# Altium project ControlPCB.PrjPcb
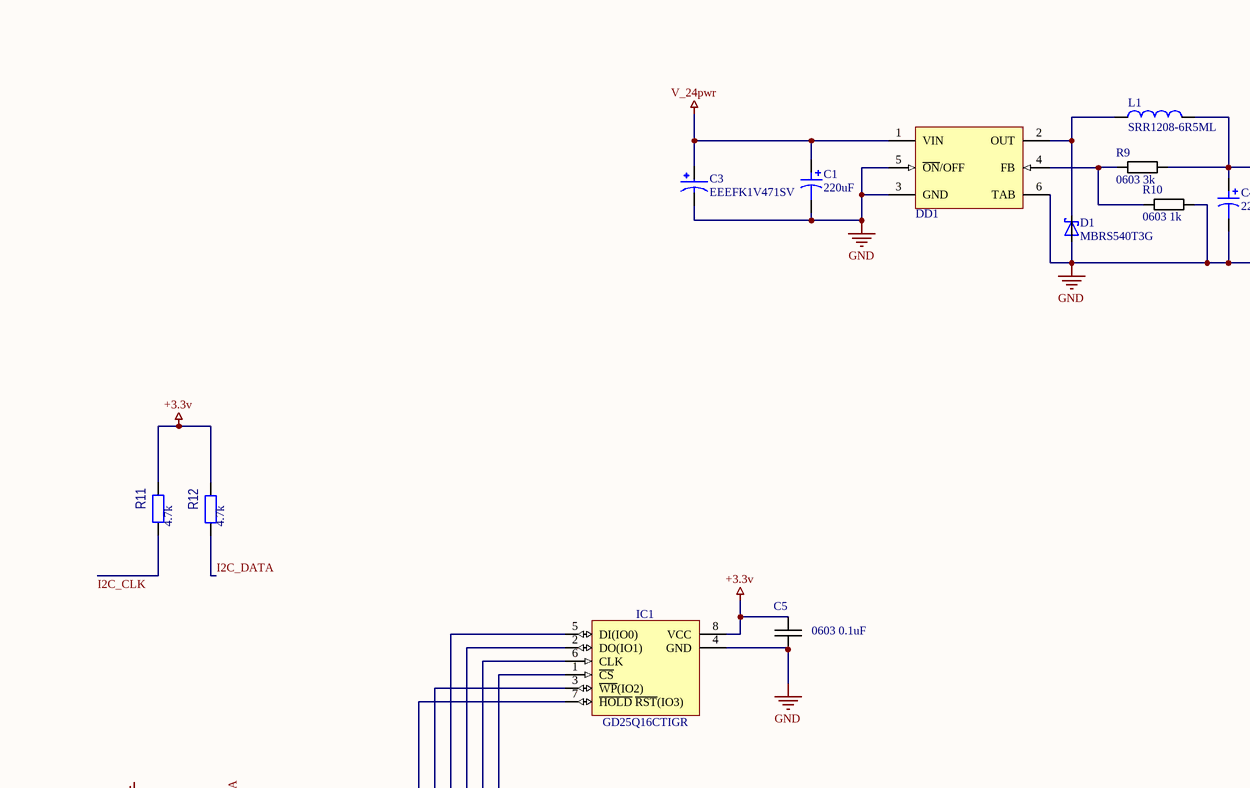
[diagram p0: ControlPCB.SchDoc, top left]
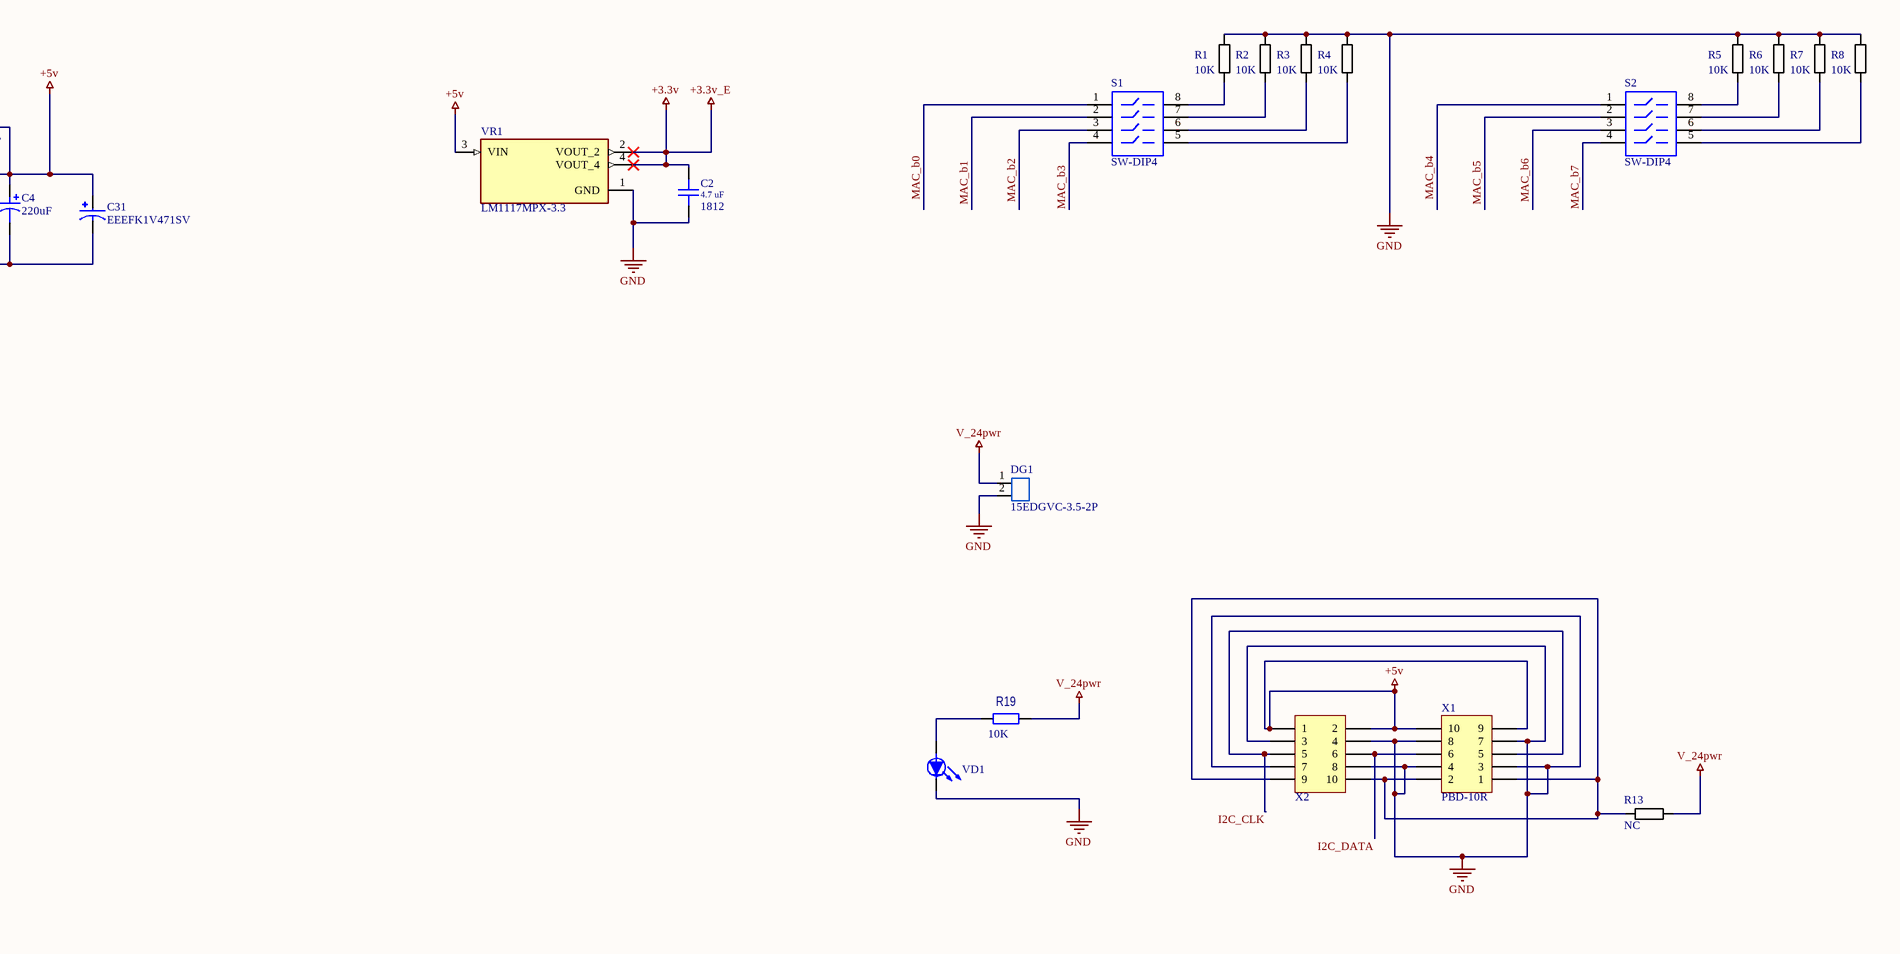
[diagram p1: ControlPCB.SchDoc, top right]
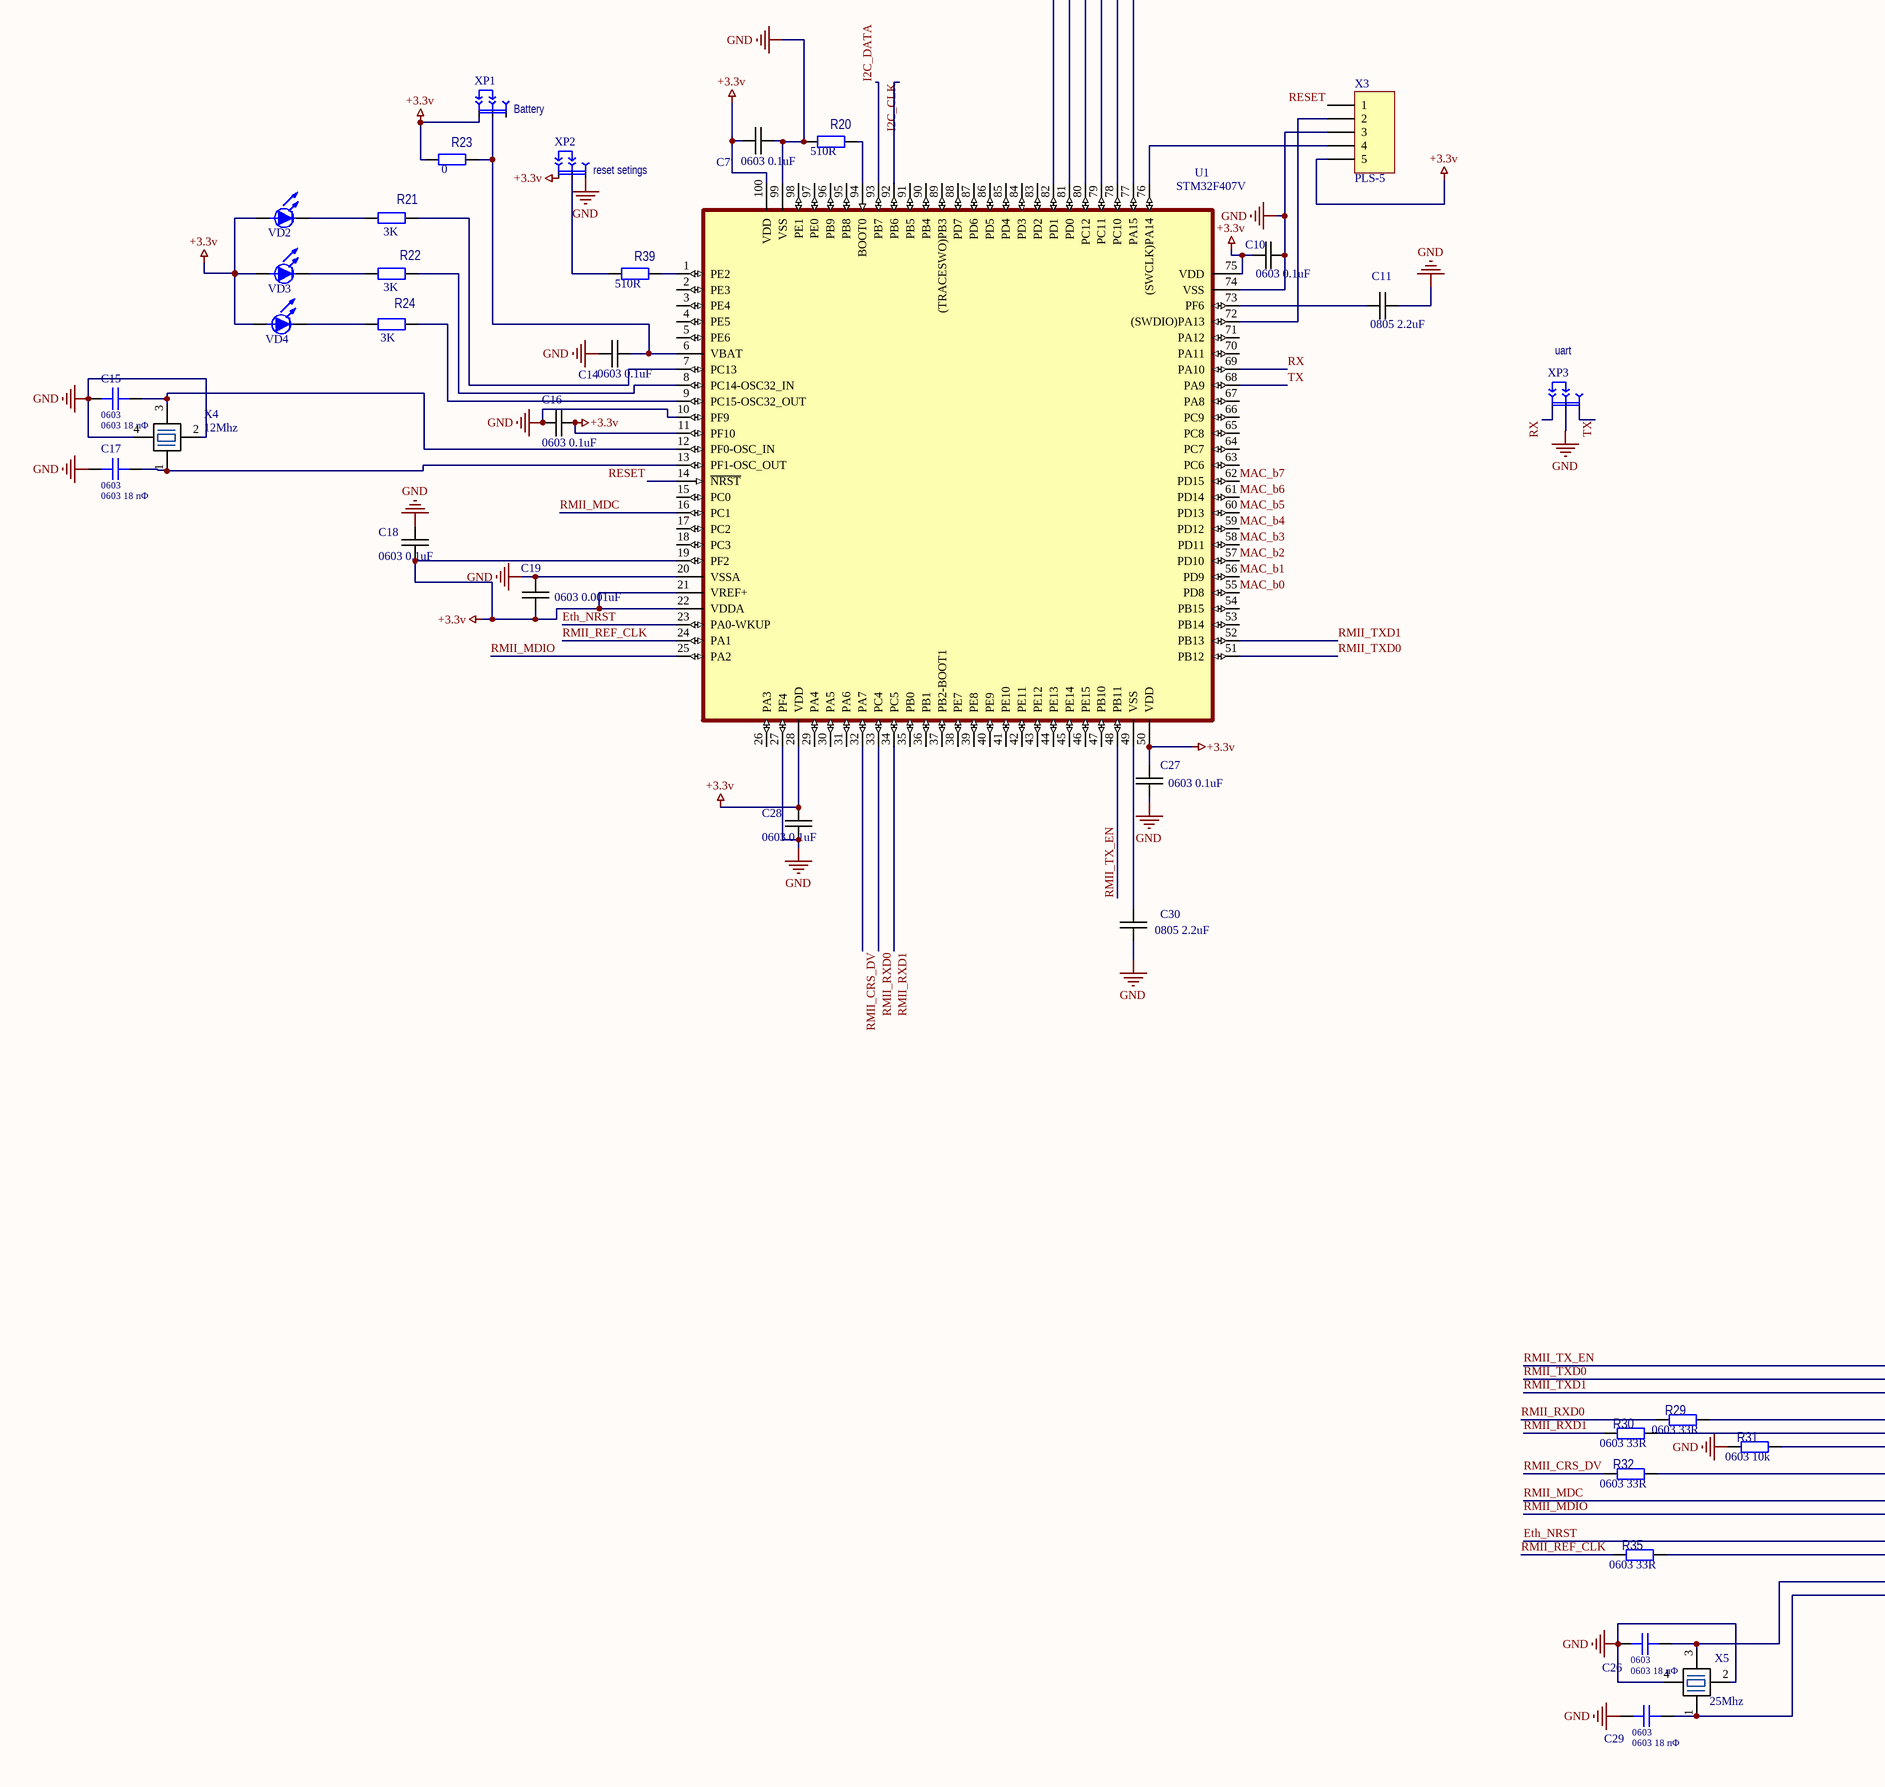
[diagram p2: ControlPCB.SchDoc, bottom left]
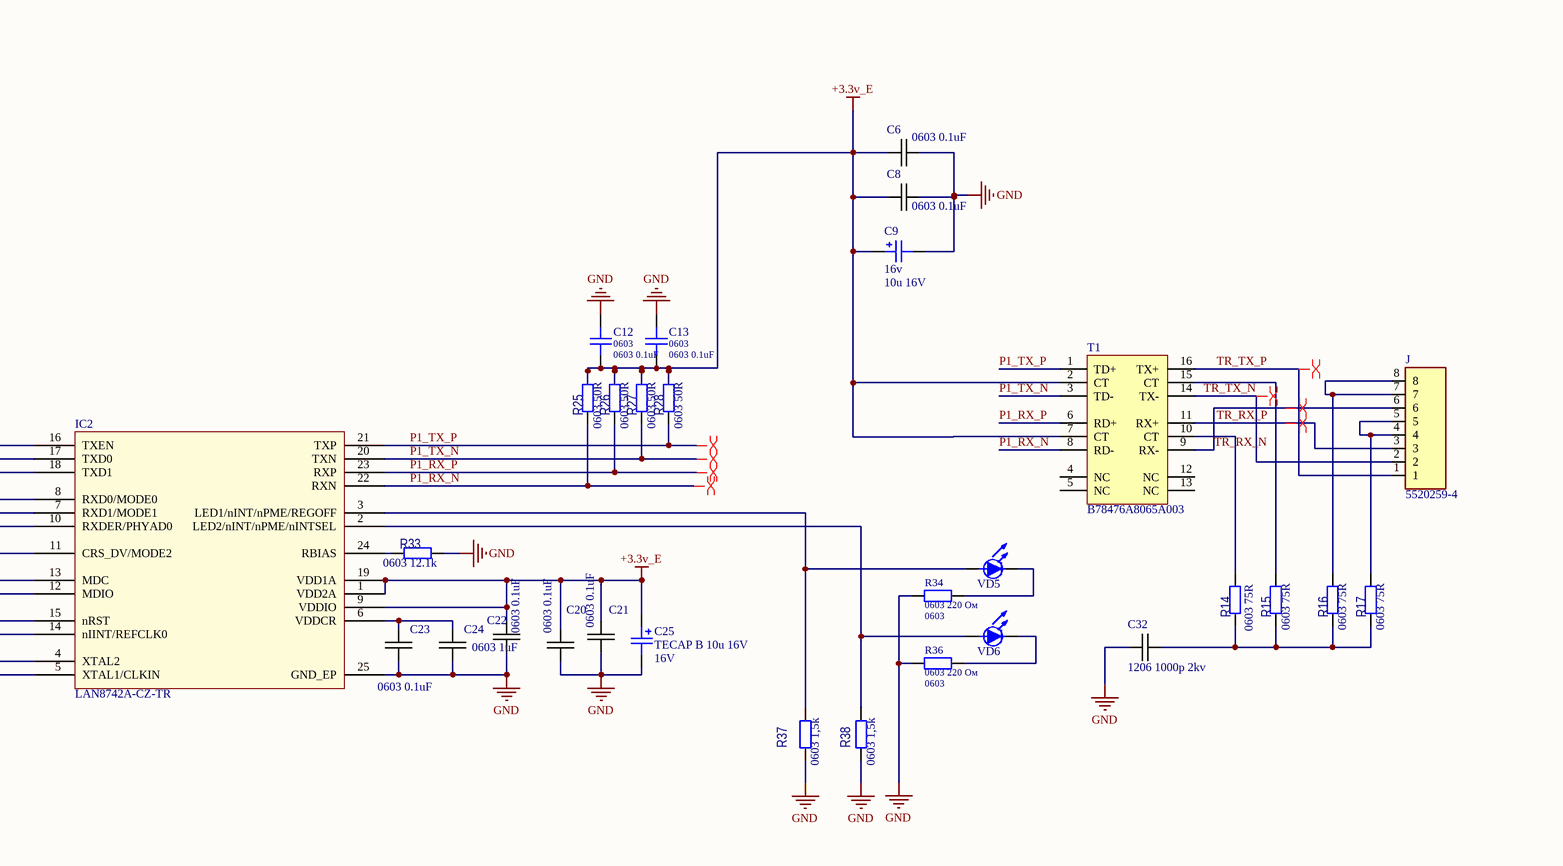
[diagram p3: ControlPCB.SchDoc, bottom right]
1 sheet, 96 parts. Net scope: global (net labels, ports and power ports of the same name join across sheets).
Board file: ControlPCB.PcbDoc

## Sheet ControlPCB.SchDoc
size A1

### Parts
C1  value 220uF  [ECR 10x13mm]  (hidden comment: NC)
C2  value 4.7 uF  Package: 1812  [CAPCHIP1812]  (hidden comment: Cap C)
C3  EEEFK1V471SV  [CAP_EEEFK1V471SV]
C4  value 220uF  [ECR 10x13mm]  (hidden comment: NC)
C5  0603 0.1uF  [CAPACITOR 0603]
C6  0603 0.1uF  [CAPACITOR 0603]
C7  0603 0.1uF  [CAPACITOR 0603]
C8  0603 0.1uF  [CAPACITOR 0603]
C9  value 10u 16V  Voltage: 16v  [TECAP B]  (hidden comment: Cap T)
C10  0603 0.1uF  [CAPACITOR 0603]
C11  0805 2.2uF  [CAPACITOR 0805]
C12  Type: 0603  [CAPCHIP0603]  (hidden comment: 0603 0.1uF)
C13  Type: 0603  [CAPCHIP0603]  (hidden comment: 0603 0.1uF)
C14  0603 0.1uF  [CAPACITOR 0603]
C15  Type: 0603  [CAPCHIP0603]  (hidden comment: 0603 18 пФ)
C16  0603 0.1uF  [CAPACITOR 0603]
C17  Type: 0603  [CAPCHIP0603]  (hidden comment: 0603 18 пФ)
C18  0603 0.1uF  [CAPACITOR 0603]
C19  0603 0.001uF  [CAPACITOR 0603]
C20  0603 0.1uF  [CAPACITOR 0603]
C21  0603 0.1uF  [CAPACITOR 0603]
C22  0603 0.1uF  [CAPACITOR 0603]
C23  0603 0.1uF  [CAPACITOR 0603]
C24  0603 1uF  [CAPACITOR 0603]
C25  Voltage: 16V  [TECAP B]  (hidden comment: TECAP B 10u 16V)
C26  Type: 0603  [CAPCHIP0603]  (hidden comment: 0603 18 пФ)
C27  0603 0.1uF  [CAPACITOR 0603]
C28  0603 0.1uF  [CAPACITOR 0603]
C29  Type: 0603  [CAPCHIP0603]  (hidden comment: 0603 18 пФ)
C30  0805 2.2uF  [CAPACITOR 0805]
C31  EEEFK1V471SV  [CAP_EEEFK1V471SV]
C32  1206 1000p 2kv  [CAPACITOR 1206]
D1  MBRS540T3G  [DIOM7958X213N]
DD1  LM2596S-ADJ  [TO-263]  (value not drawn)
DG1  15EDGVC-3.5-2P  [15EDGVC-3.5-16P]
IC1  GD25Q16CTIGR  [NSO8]
IC2  LAN8742A-CZ-TR  [LAN8742A]
J  5520259-4  [TE_5520259-4]
L1  SRR1208-6R5ML  [SRR1208]
R1  10K  [Resistor 0402]
R2  10K  [Resistor 0402]
R3  10K  [Resistor 0402]
R4  10K  [Resistor 0402]
R5  10K  [Resistor 0402]
R6  10K  [Resistor 0402]
R7  10K  [Resistor 0402]
R8  10K  [Resistor 0402]
R9  0603 3k  [Resistor 0603]
R10  0603 1k  [Resistor 0603]
R11  4.7k  [RESCHIP0603]
R12  4.7k  [RESCHIP0603]
R13  NC  [Resistor 1206]
R14  0603 75R  [RESCHIP0603]
R15  0603 75R  [RESCHIP0603]
R16  0603 75R  [RESCHIP0603]
R17  0603 75R  [RESCHIP0603]
R19  10K  [RESCHIP0603]
R20  510R  [RESCHIP0603]
R21  3K  [RESCHIP0603]
R22  3K  [RESCHIP0603]
R23  0  [RESCHIP0603]
R24  3K  [RESCHIP0603]
R25  0603 50R  [RESCHIP0603]
R26  0603 50R  [RESCHIP0603]
R27  0603 50R  [RESCHIP0603]
R28  0603 50R  [RESCHIP0603]
R29  0603 33R  [RESCHIP0603]
R30  0603 33R  [RESCHIP0603]
R31  0603 10k  [RESCHIP0603]
R32  0603 33R  [RESCHIP0603]
R33  0603 12.1k  [RESCHIP0603]
R34  Type: 0603  [RESCHIP0603]  (hidden comment: 0603 220 Ом)
R35  0603 33R  [RESCHIP0603]
R36  Type: 0603  [RESCHIP0603]  (hidden comment: 0603 220 Ом)
R37  0603 1,5k  [RESCHIP0603]
R38  0603 1,5k  [RESCHIP0603]
R39  510R  [RESCHIP0603]
S1  SW-DIP4  [DIP-8]
S2  SW-DIP4  [DIP-8]
T1  B78476A8065A003  [EPCS-B78476A8065A003-16]
U1  STM32F407V  [QFP50P1600X1600X160-100N]
VD1  (no value)  [0805-]
VD2  (no value)  [0805-]
VD3  (no value)  [0805-]
VD4  (no value)  [0805-]
VD5  (no value)  [0805-]
VD6  (no value)  [0805-]
VR1  LM1117MPX-3.3  [VREG_LM1117MPX-3.3]
X1  PBD-10R  [PBD-10RR]
X2  PLD-10R  [PLD-10RR1]  (value not drawn)
X3  PLS-5  [PLS-5-3D]
X4  12Mhz  [XTAL_3.2_2.5]
X5  25Mhz  [XTAL_3.2_2.5]
XP1  Battery  [ZL201-3]
XP2  reset setings  [ZL201-3]
XP3  uart  [ZL201-3]

### Nets
+3.3v: C2.2 C5.1 C6.1 C7.1 C8.1 C9.1 C10.1 C12.1 C13.1 C16.2 C18.2 C19.2 C20.1 C21.2 C22.1 C25.1 C27.1 C28.1 IC1.8(VCC) IC2.1(VDD2A) IC2.9(VDDIO) IC2.19(VDD1A) R11.2 R12.2 R23.1 R25.2 R26.2 R27.2 R28.2 T1.2(CT) T1.7(CT) U1.11(PF10) U1.19(PF2) U1.21(VREF+) U1.22(VDDA) U1.28(VDD) U1.50(VDD) U1.75(VDD) U1.100(VDD) VD2.A(a) VD3.A(a) VD4.A(a) VR1.2(VOUT_2) VR1.4(VOUT_4) X3.5 XP1.1 XP2.1  [also labelled +3.3v_E]
+5v: C4.1 C31.1 L1.P$2 R9.2 VR1.3(VIN) X1.9 X1.10 X2.1 X2.2
GND: C1.2 C2.1 C3.2 C4.2 C5.2 C6.2 C7.2 C8.2 C9.2 C10.2 C11.2 C12.2 C13.2 C14.1 C15.1 C16.1 C17.1 C18.1 C19.1 C20.2 C21.1 C22.2 C23.2 C24.2 C25.2 C26.1 C27.2 C28.2 C29.1 C30.1 C31.2 C32.2 D1.A DD1.3(GND) DD1.5(~{ON}/OFF) DD1.6(TAB) DG1.2 IC1.4(GND) IC2.25(GND_EP) R1.1 R2.1 R3.1 R4.1 R5.1 R6.1 R7.1 R8.1 R10.2 R20.1 R31.1 R33.2 R34.1 R36.1 R37.1 R38.1 U1.10(PF9) U1.20(VSSA) U1.27(PF4) U1.74(VSS) U1.99(VSS) VD1.K(k) VR1.1(GND) X1.3 X1.4 X1.7 X1.8 X2.3 X2.4 X2.7 X2.8 X3.3 X4.2 X4.4 X5.2 X5.4 XP2.3 XP3.2
V_24pwr: C1.1 C3.1 DD1.1(VIN) DG1.1 R13.2 R19.2
Eth_NRST: IC2.15(nRST) U1.23(PA0-WKUP)
I2C_CLK: R11.1 U1.92(PB6) X1.5 X2.5
I2C_DATA: R12.1 U1.93(PB7) X1.6 X2.6
MAC_b0: S1.1 U1.55(PD8)
MAC_b1: S1.2 U1.56(PD9)
MAC_b2: S1.3 U1.57(PD10)
MAC_b3: S1.4 U1.58(PD11)
MAC_b4: S2.1 U1.59(PD12)
MAC_b5: S2.2 U1.60(PD13)
MAC_b6: S2.3 U1.61(PD14)
MAC_b7: S2.4 U1.62(PD15)
P1_RX_N: IC2.22(RXN) R25.1 T1.8(RD-)
P1_RX_P: IC2.23(RXP) R26.1 T1.6(RD+)
P1_TX_N: IC2.20(TXN) R27.1 T1.3(TD-)
P1_TX_P: IC2.21(TXP) R28.1 T1.1(TD+)
RESET: U1.14(~{NRST}) X3.1
RMII_CRS_DV: R32.1 U1.32(PA7)
RMII_MDC: IC2.13(MDC) U1.16(PC1)
RMII_MDIO: IC2.12(MDIO) U1.25(PA2)
RMII_REF_CLK: R35.1 U1.24(PA1)
RMII_RXD0: R29.1 U1.33(PC4)
RMII_RXD1: R30.1 U1.34(PC5)
RMII_TX_EN: IC2.16(TXEN) U1.48(PB11)
RMII_TXD0: IC2.17(TXD0) U1.51(PB12)
RMII_TXD1: IC2.18(TXD1) U1.52(PB13)
RX: U1.69(PA10) XP3.1
TR_RX_N: J.6 T1.9(RX-)
TR_RX_P: J.3 T1.11(RX+)
TR_TX_N: J.2 T1.14(TX-)
TR_TX_P: J.1 T1.16(TX+)
TX: U1.68(PA9) XP3.3
NetC11_1: C11.1 U1.73(PF6)
NetC14_2: C14.2 R23.2 U1.6(VBAT) XP1.2
NetC15_2: C15.2 U1.12(PF0-OSC_IN) X4.3
NetC17_2: C17.2 U1.13(PF1-OSC_OUT) X4.1
NetC23_1: C23.1 C24.1 IC2.6(VDDCR)
NetC26_2: C26.2 IC2.4(XTAL2) X5.3
NetC29_2: C29.2 IC2.5(XTAL1/CLKIN) X5.1
NetC30_2: C30.2 U1.49(VSS)
NetC32_1: C32.1 R14.1 R15.1 R16.1 R17.1
NetD1_C: D1.C DD1.2(OUT) L1.P$1
NetDD1_4: DD1.4(FB) R9.1 R10.1
NetIC1_1: IC1.1(~{CS}) U1.77(PA15)
NetIC1_2: IC1.2(DO(IO1)) U1.79(PC11)
NetIC1_3: IC1.3(~{WP}(IO2)) U1.81(PD0)
NetIC1_5: IC1.5(DI(IO0)) U1.80(PC12)
NetIC1_6: IC1.6(CLK) U1.78(PC10)
NetIC1_7: IC1.7(~{HOLD}_~{RST}(IO3)) U1.82(PD1)
NetIC2_2: IC2.2(LED2/nINT/nPME/nINTSEL) R38.2 VD6.A(a)
NetIC2_3: IC2.3(LED1/nINT/nPME/REGOFF) R37.2 VD5.A(a)
NetIC2_7: IC2.7(RXD1/MODE1) R30.2
NetIC2_8: IC2.8(RXD0/MODE0) R29.2
NetIC2_10: IC2.10(RXDER/PHYAD0) R31.2
NetIC2_11: IC2.11(CRS_DV/MODE2) R32.2
NetIC2_14: IC2.14(nIINT/REFCLK0) R35.2
NetIC2_24: IC2.24(RBIAS) R33.1
NetJ_4: J.4 J.5 R17.2
NetJ_7: J.7 J.8 R16.2
NetR1_2: R1.2 S1.8
NetR2_2: R2.2 S1.7
NetR3_2: R3.2 S1.6
NetR4_2: R4.2 S1.5
NetR5_2: R5.2 S2.8
NetR6_2: R6.2 S2.7
NetR7_2: R7.2 S2.6
NetR8_2: R8.2 S2.5
NetR13_1: R13.1 X1.1 X1.2 X2.9 X2.10
NetR14_2: R14.2 T1.10(CT)
NetR15_2: R15.2 T1.15(CT)
NetR19_1: R19.1 VD1.A(a)
NetR20_2: R20.2 U1.94(BOOT0)
NetR21_1: R21.1 U1.7(PC13)
NetR21_2: R21.2 VD2.K(k)
NetR22_1: R22.1 U1.8(PC14-OSC32_IN)
NetR22_2: R22.2 VD3.K(k)
NetR24_1: R24.1 U1.9(PC15-OSC32_OUT)
NetR24_2: R24.2 VD4.K(k)
NetR34_2: R34.2 VD5.K(k)
NetR36_2: R36.2 VD6.K(k)
NetR39_1: R39.1 XP2.2
NetR39_2: R39.2 U1.1(PE2)
NetU1_72: U1.72((SWDIO)PA13) X3.2
NetU1_76: U1.76((SWCLK)PA14) X3.4

Not connected (* = marked no-connect by the designer): T1 4(NC) 5(NC) 12(NC) 13(NC); U1 2(PE3) 3(PE4) 4(PE5) 5(PE6) 15(PC0) 17(PC2) 18(PC3) 26(PA3) 29(PA4) 30(PA5) 31(PA6) 35(PB0) 36(PB1) 37(PB2-BOOT1) 38(PE7) 39(PE8) 40(PE9) 41(PE10) 42(PE11) 43(PE12) 44(PE13) 45(PE14) 46(PE15) 47(PB10) 53(PB14) 54(PB15) 63(PC6) 64(PC7) 65(PC8) 66(PC9) 67(PA8) 70(PA11) 71(PA12) 83(PD2) 84(PD3) 85(PD4) 86(PD5) 87(PD6) 88(PD7) 89((TRACESWO)PB3) 90(PB4) 91(PB5) 95(PB8) 96(PB9) 97(PE0) 98(PE1); XP1 3

### Layout directives
differential pair: P1_RX_N, P1_RX_P, P1_TX_N, P1_TX_P, TR_RX_N, TR_RX_P, TR_TX_N, TR_TX_P

### Library data of the parts
C1 C4 = Cap Pol: Polarized Capacitor (Rad); Voltage: 50; Type: Type; URL: http://www.hitano.com.tw/PDF/ECR_081225.pdf; Package: 10x13
C2 = Cap C: Ceramic Capacitor; Class: Электронные компоненты; SubClass: Конденсаторы; TKE: {TKE}; Ordering_Information: {Ordering_Information}; Installation: {Installation}; Body: {Body}; Nominal_voltage_V: {Nominal_voltage_V}; Tolerance_Percent: {Tolerance_Percent}; Pins: {Pins}
C3 C31 = EEEFK1V471SV: 470ÂµF 35V Aluminum Electrolytic Capacitors Radial, Can - SMD 80mOhm @ 100kHz 2000 Hrs @ 105Â°C; MP: EEE-FK1V471SV; MF: Panasonic Electronic Components; Package: RADIAL-2 Panasonic; Availability: In Stock; Value: *; SnapEDA_Link: https://www.snapeda.com/parts/EEE-FK1V471SV/Panasonic/view-part/?ref=snap; Price: None; Check_prices: https://www.snapeda.com/parts/EEE-FK1V471SV/Panasonic/view-part/?ref=eda; Purchase-URL: https://pricing.snapeda.com/search/part/EEE-FK1V471SV/?ref=eda
C5-C8 C10 C11 C14 C16 C18-C24 C27 C28 C30 C32 = Capasitor
  C5-C8 C10 C14 C16 C18 C20-C23 C27 C28: Value: 0603 0.1uF; Package: 0603
  C11 C30: Value: 0805 2.2uF; Package: 0805
  C19: Value: 0603 0.001uF; Package: 0603
  C24: Value: 0603 1uF; Package: 0603
  C32: Value: 1206 1000p 2kv; Package: 1206
C9 C25 = Cap T: Solid Tantalum Surface Mount Capacitors; Package: TECAP B
  C9: Type: Type
  C25: Value: TECAP B 10u 16V; Type: TECAP B
C12 C13 C15 C17 C26 C29 = Cap C: Керамическтй конденсатор SMD C0603; Package: 0603
  C12 C13: Value: 0603 0.1uF
  C15 C17 C26 C29: Value: 0603 18 пФ
D1 = MBRS540T3G: Diode Schottky 40V 5A Surface Mount SMC; Value: 0603 0.1uF; MF: ON Semiconductor; SnapEDA_Link: https://www.snapeda.com/parts/MBRS540T3G/ON%20Semiconductor/view-part/78777/?ref=snap; MP: MBRS540T3G; Availability: Unavailable; Price: None; Package: DO-214 ON Semiconductor
DD1 = LM2596S-ADJ: SIMPLE SWITCHER® Power Converter 150 KHz 3A Step-Down Voltage Regulator, 5-pin TO-263; Manufacturer: National Semiconductor; Published: 13.04.2012; Publisher: Reukov A.V.; PartNumber: LM2596S-ADJ; CompType: Switcher; ComponentLink1URL: http://www.national.com/ds/LM/LM2596.pdf; ComponentLink2URL: http://www.national.com/pf/LM/LM2596.html; ComponentLink3URL: http://www.national.com/packaging/folders/ts5b.html; Value: LM2596S-ADJ
IC1 = W25Q128FVEIG: 128M-bit Serial Flash Memory with uniform 4KB sectors and Dual/Quad SPI and QPI; Value: GD25Q16CT
J = 5520259-4: Jack Modular Connector 8p8c _RJ45, Ethernet_ Vertical Unshielded Cat3; MF: TE Connectivity; Number_of_Positions: 8; Centerline_Pitch: 1.02 mm[.04 in]; TE_purchase_URL: https://www.te.com/usa-en/product-5520259-4.html?te_bu=Cor&te_type=disp&te_campaign=seda_glo_cor-seda-global-disp-prtnr-fy19-seda-model-bom-cta_sma-317_1&elqCampaignId=32493; EU_RoHS_Compliance: Compliant; Package: None; Availability: Unavailable; MP: 5520259-4; Value: *; SnapEDA_Link: https://www.snapeda.com/parts/5520259-4/TE%20Connectivity%20AMP%20Connectors/view-part/2000900/?ref=snap; Price: None
L1 = SRR1208-6R5ML: 6.5ÂµH Shielded Wirewound Inductor 6A 18mOhm Max Nonstandard; MF: Bourns; Availability: Unavailable; SnapEDA_Link: https://www.snapeda.com/parts/SRR1208-6R5ML/Bourns/view-part/353452/?ref=snap; Value: SRR1208-6R5ML; Package: Nonstandard Bourns; MP: SRR1208-6R5ML; Price: None
R1-R10 R13 = Resistor
  R1-R8: Value: 10K; Package: 0402
  R9: Value: 0603 3k; Package: 0603
  R10: Value: 0603 1k; Package: 0603
  R13: Value: NC; Package: 1206
R11 R12 R19-R24 R39 = Res: Resistor; Tolerance_Percent: {Tolerance_Percent}; Pins: 2; Package: 0603; CompType: Resistor
  R11 R12: Value: 4.7k
  R19: Value: 10K
  R20 R39: Value: 510R
  R21 R22 R24: Value: 3K
  R23: Value: 0
R14-R17 R25-R33 R35 R37 R38 = Res: Резистор; Tolerance_Percent: {Tolerance_Percent}; Class: Электронные компоненты; SubClass: Резисторы; Power_W: {Power_W}; Installation: {Installation}; Ordering_Information: {Ordering_Information}; Body: {Body}; Pins: 2; Package: 0603
  R14-R17: Value: 0603 75R
  R25-R28: Value: 0603 50R
  R29 R30 R32 R35: Value: 0603 33R
  R31: Value: 0603 10k
  R33: Value: 0603 12.1k
  R37 R38: Value: 0603 1,5k
R34 R36 = Res: Резистор SMD R0603; Tolerance: %; PWR: Value; Value: 0603 220 Ом; Package: 0603
S1 S2 = SW-DIP4: DIP Switch; Published: 24-Mar-1999; LatestRevisionDate: 17-Jul-2002; LatestRevisionNote: Re-released for DXP Platform.; PackageReference: DIP-8; Publisher: Altium Limited; Package: SW-DIP8
T1 = B78476A8065A003: Magnetics Modules for LAN Application, 10/100 Base-T Magnetics Module, 1 Port, 0 to 70 degC, 16-Pin SMD, RoHS, Tape and Reel; Manufacturer: EPCOS; Insertion loss: -1.0 dB max.; Turns Ratio: 1CT +/- 3%; Voltage Test: 1500 V AC; Ports: 1; Inductance L: 350 uH min.; PartNumber: B78476A8065A003; ComponentLink1Description: Manufacturer URL; ComponentLink2Description: Datasheet; DatasheetVersion: 08/2012; ComponentLink3URL: http://www.epcos.com/inf/30/ds/lan_mod/B78476A8065A003.pdf; ComponentLink3Description: Package Specification; ComponentLink1URL: http://www.epcos.com/; Packing: Tape and Reel; ComponentLink2URL: http://www.epcos.com/inf/30/ds/lan_mod/B78476A8065A003.pdf; PackageReference: B78476A8065A003-16; Operating Temperature Range: 0 to 70 degC; PackageVersion: 08/2012; RoHS: TRUE; Weight: 0.8 g; Mounting Technology: Surface Mount; PackageDescription: 16-Pin Surface Mount Device, Body 12.7 x 7.11 mm, Pitch 1.27 mm
U1 = STM32F303V: ARMÂ® CortexÂ®-M4 STM32F3 Microcontroller IC 32-Bit 72MHz 100-LQFP (14x14); MF: STMicroelectronics; Price: None; Value: STM32F407V; Availability: Unavailable; Package: LQFP-100 STMicroelectronics; MP: STM32F303V
VD1 = LED SMD: Value: 0805; CompType: LED; Pins: 2; Package: 0805
VD2 = LED SMD: Value: 0805; CompType: LED; Note: Read; Pins: 2; Package: 0805
VD3 = LED SMD: Value: 0805; CompType: LED; Note: Green; Pins: 2; Package: 0805
VD4-VD6 = LED SMD: Value: 0805; CompType: LED; Note: Blue; Pins: 2; Package: 0805
VR1 = LM1117MPX-3.3: 800-mA 15-V linear voltage regulator; MF: Texas Instruments; Check_prices: https://www.snapeda.com/parts/LM1117MPX-3.3/Texas+Instruments/view-part/?ref=eda; Value: LM1117MPX-3.3; Availability: In Stock; MP: LM1117MPX-3.3; Price: None; Package: SOT-223-4 Texas Instruments; SnapEDA_Link: https://www.snapeda.com/parts/LM1117MPX-3.3/Texas+Instruments/view-part/?ref=snap; Purchase-URL: https://pricing.snapeda.com/search/part/LM1117MPX-3.3/?ref=eda
X1 = PBD-10R: Header, 5-Pin, Dual row; Package: NC
X2 = PLD-10R: Header, 5-Pin, Dual row; Package: NC
X3 = PLS-5: Header, 5-Pin; LatestRevisionDate: 17-Jul-2002; LatestRevisionNote: Re-released for DXP Platform.; Publisher: Altium Limited
X4 = XTAL 2-pin: Value: 3.3_2.5 12Mhz
X5 = XTAL 2-pin: Value: 3.3_2.5 25Mhz
XP1 = Select jump: Class: Электронные компоненты; SubClass: Разъемы; Pitch_mm: {Pitch_mm}; Installation: DIP; Ordering_Information: {Ordering_Information}; Type_of_connector: {Type_of_connector}; Pins: 3; Value: Battery; Package: NC
XP2 XP3 = Select jump: Ter120; Class: Электронные компоненты; SubClass: Разъемы; Pitch_mm: {Pitch_mm}; Installation: DIP; Ordering_Information: {Ordering_Information}; Type_of_connector: {Type_of_connector}; Pins: 3; Package: NC
  XP2: Value: reset setings
  XP3: Value: uart
IC2 = LAN8742A-CZ-TR: Value: LAN8742A-CZ-TR